# Altium schematic sheet Schematic.SchDoc
size A4; SheetNumber: 1; SheetTotal: 1
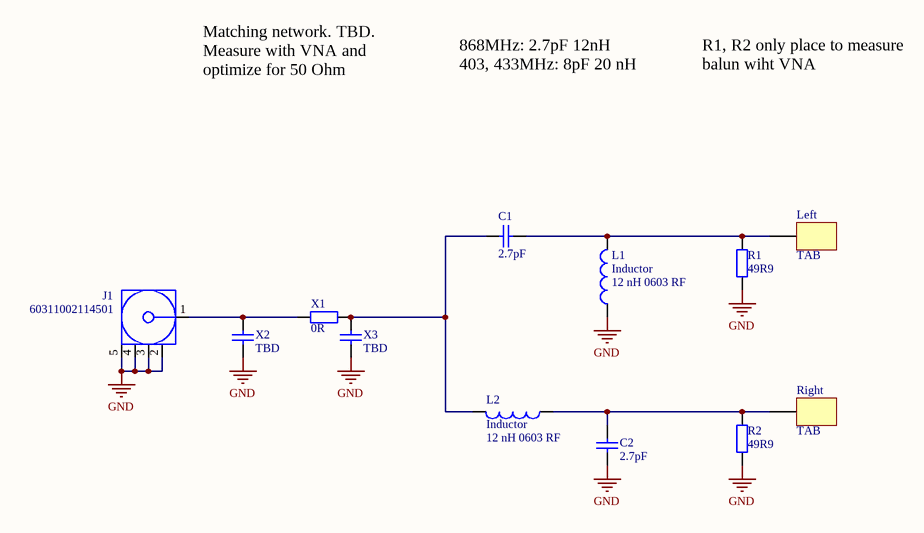
[diagram p0: Schematic.SchDoc]

## Parts
C1  value 2.7pF  [CAPC0603N]  (hidden comment: Cap)
C2  value 2.7pF  [CAPC0603N]  (hidden comment: Cap)
J1  60311002114501  [60311002114501]
L1  Inductor  SCH: 12 nH 0603 RF  [CAPC0603N]
L2  Inductor  SCH: 12 nH 0603 RF  [CAPC0603N]
Left  TAB  [TAB]
R1  value 49R9  [RESC0603N]  (hidden comment: Res)
R2  value 49R9  [RESC0603N]  (hidden comment: Res)
Right  TAB  [TAB]
X1  value 0R  [RESC0603N]  (hidden comment: Res)
X2  value TBD  [CAPC0603N]  (hidden comment: Cap)
X3  value TBD  [CAPC0603N]  (hidden comment: Cap)

## Nets
GND: C2.1 J1.2(GND) J1.3(GND) J1.4(GND) J1.5(GND) L1.1 R1.1 R2.1 X2.1 X3.1
NetC1_1: C1.1 L1.2 Left.1 R1.2
NetC1_2: C1.2 L2.2 X1.2 X3.2
NetC2_2: C2.2 L2.1 R2.2 Right.1
NetJ1_1: J1.1(Signal) X1.1 X2.2

## Notes on the sheet
- Matching network. TBD. Measure with VNA and optimize for 50 Ohm
- 868MHz: 2.7pF 12nH
  403, 433MHz: 8pF 20 nH
- R1, R2 only place to measure balun wiht VNA

## Library data of the parts
C1 C2 = C16149: Multilayer Ceramic Capacitors MLCC - SMD/SMT 2.7pF 50V 0603 RoHS; MFR: CL10C2R7CB8NNNC; Manufacturer: Samsung Electro-Mechanics; Basic/Extended: B; Temperature Coefficient: C0G; pf: 2.7; #LCSC: C16149; Price: 0.009$/unit; Package: 0603; Voltage - Rated: 50V
J1 = CMP-03913-97004421-3: Rf Coax Conn, Sma R/A Jack, 50 Ohm, Pcb Rohs Compliant: Yes; Insulation Resistance: 5GΩ; Insertion Loss (dB): 0.14dB; Impedance: 50Ω; Max Operating Temperature: 165°C; Orientation: Right Angle; Connector Type: SMA; Min Operating Temperature: -65°C; Insulation Material: PTFE
L1 L2 = 744786112: MANUF: WE; DESCIPTION: INDUCTOR SMD RF 12 nH ±5% ±5% 600 mA 0603; VALUE: 12 nH; NoPins: 2; SUPPLY: SUB; TECH: Multilayer Ceramic SMT Inductor; MANUFCODE: 744786112; DIGIKEY: TBD; FARNELL: TBD; SMD: YES
R1 R2 = C23185: Chip Resistor - Surface Mount 49.9Ohms ±1% 1/10W 0603 RoHS; MANUFCODE: 0603WAF499JT5E; MANUF: Uniroyal Elec; B/E: B; #JLCPCB: C23185; Package: '0603
X1 = C21189: Chip Resistor - Surface Mount 0Ohms ±1% 1/10W 0603 RoHS; MANUFCODE: 0603WAF0000T5E; MANUF: Uniroyal Elec; B/E: B; #JLCPCB: C21189; Package: '0603
X2 X3 = C23969: Multilayer Ceramic Capacitors MLCC - SMD/SMT 1pF 50V 0603 RoHS; MFR: CL10C010CB8NNNC; Manufacturer: Samsung Electro-Mechanics; Basic/Extended: B; Temperature Coefficient: C0G; pf: 1; #LCSC: C23969; Price: 0.007$/unit; Package: 0603; Voltage - Rated: 50V